# Altium schematic sheet NPN_CONNECTOR.SchDoc: BMS - AFE
size A4; DrawnBy: Jarod Krane; SheetNumber: 7; SheetTotal: 8
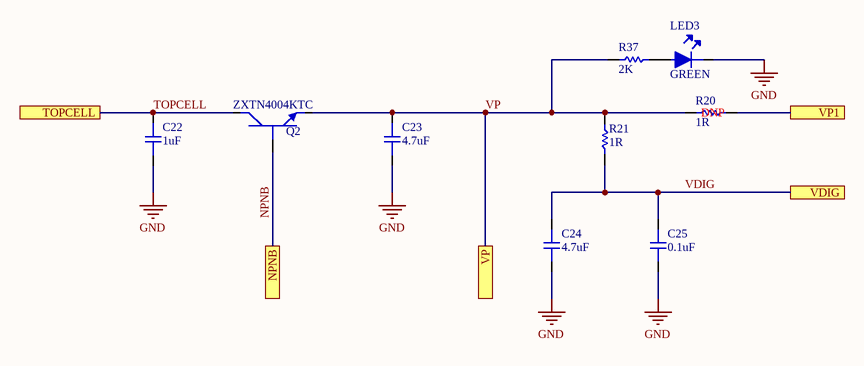
[diagram p0: NPN_CONNECTOR.SchDoc]

## Parts
C22  1uF  [0805 CAP]
C23  4.7uF  [1206 CAP]
C24  4.7uF  [0805 CAP]
C25  0.1uF  [0603 CAP - duplicate]
LED3  GREEN  [LED2]
Q2  ZXTN4004KTC  [NPN TRANSISTOR]
R20  1R  [0603 RES]
R21  1R  [0603 RES]
R37  2K  [0603 RES]

## Ports
NPNB, TOPCELL, VDIG, VP, VP1

## Nets
GND: C22.1 C23.1 C24.1 C25.1 LED3.2
NPNB: Q2.1 ; port NPNB
TOPCELL: C22.2 Q2.2 ; port TOPCELL
VDIG: C24.2 C25.2 R21.1 ; port VDIG
VP: C23.2 Q2.3 R20.1 R21.2 R37.1 ; port VP
VP1: R20.2 ; port VP1
NetLED3_1: LED3.1 R37.2

## Notes on the sheet
- (near R20) DNP

## Library data of the parts
C22 = C2012X7S2A105K125AE: CAP CER 1UF 100V X7S 0805; Manufacturer: TDK; Tolerance: 10%; Supplier 1: Digi-Key; Manufacturer Part Number: C2012X7S2A105K125AE; Stock 1: 20000; Pricing 1: 1=0.5, 10=0.356, 100=0.2347, 500=0.1739, 1000=0.1478 (USD); Mount: Surface Mount; Case/Package: 0805; Case Code (Metric): 2012; Case Code (Imperial): 0805; Min Operating Temperature: -55°C; Max Operating Temperature: 125°C; Capacitance: 1uF; Voltage Rating: 100V; Packaging: Tape and Reel; Termination: SMD/SMT; Package Quantity: 1; Voltage Rating (DC): 100V; Dielectric: X7S; Composition: Ceramic; Features: Soft Termination; Length: 2mm; Height: 1.25mm; Width: 0.05inch; Thickness: 0.049inch; Depth: 1.25mm; Lead Free: Lead Free; ComponentLink1URL: https://product.tdk.com/info/en/catalog/spec/mlccspec_commercial_soft_en.pdf; ComponentLink1Description: https://product.tdk.com/info/en/catalog/spec/mlccspec_commercial_soft_en.pdf; ComponentLink2URL: http://www.mouser.com/ds/2/400/lcc_commercial_soft_en-520032.pdf; ComponentLink2Description: http://www.mouser.com/ds/2/400/lcc_commercial_soft_en-520032.pdf; Supplier Part Number 1: 445-8887-1-ND
C23 = GRM31CR71H475KA12L: CAP CER 4.7UF 50V X7R 1206; Manufacturer: Murata; Material: Ceramic; Tolerance: 10%; Supplier 1: Digi-Key; Manufacturer Part Number: GRM31CR71H475KA12L; Stock 1: 0; Pricing 1: 1=0.98, 10=0.723, 100=0.4961, 500=0.3928, 1000=0.3307 (USD); Mount: Surface Mount; Case/Package: 1206; Case Code (Metric): 3216; Case Code (Imperial): 1206; Min Operating Temperature: -55°C; Max Operating Temperature: 125°C; Capacitance: 4.7uF; Voltage Rating: 50V; Packaging: Tape and Reel; Voltage Rating (DC): 50V; Package Quantity: 2000; Dielectric: X7R; Termination: SMD/SMT; Voltage: 50V; Length: 3.2mm; Height: 1.6mm; Width: 0.063inch; Thickness: 0.071inch; Depth: 1.6mm; Radiation Hardening: No; REACH SVHC: No SVHC; Lead Free: Lead Free; Supplier Part Number 1: 490-6521-1-ND
C24 = CL21B475KOFNFNE: CAP CER 4.7UF 16V X7R 0805; Manufacturer: Samsung; Tolerance: 10%; Supplier 1: Digi-Key; Manufacturer Part Number: CL21B475KOFNFNE; Stock 1: 20000; Pricing 1: 1=0.3, 10=0.208, 100=0.1181, 500=0.0833, 1000=0.0729 (USD); Mount: Surface Mount; Case/Package: 0805; Case Code (Metric): 2012; Case Code (Imperial): 0805; Min Operating Temperature: -55°C; Max Operating Temperature: 125°C; Package Quantity: 1; Packaging: Tape and Reel; Capacitance: 4.7uF; Voltage Rating: 16V; Dielectric: X7R; Length: 0.079inch; Height: 1.25mm; Width: 0.049inch; Thickness: 0.053inch; Depth: 1.25mm; Radiation Hardening: No; Supplier Part Number 1: 1276-2970-1-ND
C25 = 06035C104KAZ2A: CAP CER 0.1UF 50V X7R 0603; Manufacturer: Kyocera AVX; Capacitance: 100nF; Tolerance: 10%; Temperature Coefficient: 30ppm/°C; Supplier 1: Digi-Key; Manufacturer Part Number: 06035C104KAZ2A; Stock 1: 40000; Pricing 1: 1=0.23, 10=0.161, 100=0.0756, 500=0.053, 1000=0.0439 (USD); Mount: PCB,Surface Mount; Case/Package: 0603; Number of Pins: 2; Case Code (Metric): 1608; Case Code (Imperial): 0603; Contact Plating: Matte,Tin; Min Operating Temperature: -55°C; Max Operating Temperature: 125°C; Package Quantity: 1; Voltage Rating: 50V; Packaging: Tape and Reel; Voltage Rating (DC): 50V; Dielectric: X7R; Termination: SMD/SMT; Voltage: 50V; Features: Soft Termination; Length: 1.6mm; Height: 0.94mm; Width: 0.032inch; Thickness: 0.035inch; Depth: 0.81mm; Radiation Hardening: No; REACH SVHC: No SVHC; Lead Free: Lead Free; Supplier Part Number 1: 478-3540-1-ND
LED3 = 150060VS75000: LED GREEN CLEAR 0603 SMD; Manufacturer: Wurth Electronics; Luminous Intensity: 40mcd; Viewing Angle: 140°; Forward Voltage: 2V; Wavelength: 570nm; Lens Style: Clear,Rectangular; Forward Current: 30mA; Test Current: 20mA; Supplier 1: Digi-Key; Manufacturer Part Number: 150060VS75000; Stock 1: 219425; Pricing 1: 1=0.14, 50=0.129, 100=0.11, 500=0.095 (USD); Mount: Surface Mount; Case/Package: 0603; Number of Pins: 2; Colour: Green; Case Code (Metric): 1608; Case Code (Imperial): 0603; Min Operating Temperature: -40°C; Max Operating Temperature: 85°C; Package Quantity: 1; Packaging: Tape and Reel; Dominant Wavelength: 570nm; Length: 1.6mm; Height: 0.7mm; Width: 0.8mm; REACH SVHC: Unknown; ComponentLink1URL: http://www.farnell.com/datasheets/1911347.pdf; ComponentLink1Description: http://www.farnell.com/datasheets/1911347.pdf; ComponentLink2URL: https://katalog.we-online.de/led/datasheet/150060VS75000.pdf; ComponentLink2Description: https://katalog.we-online.de/led/datasheet/150060VS75000.pdf; ComponentLink3URL: https://www.distrelec.biz/Web/Downloads/_t/ds/150060VS75000_eng_tds.pdf?mime=application%2Fpdf; ComponentLink3Description: https://www.distrelec.biz/Web/Downloads/_t/ds/150060VS75000_eng_tds.pdf?mime=application%2Fpdf; ComponentLink4URL: http://www.produktinfo.conrad.com/datenblaetter/750000-774999/759431-da-01-en-CHIPLED_0603_W_KL_H_GRUEN_150060VS7500.pdf; ComponentLink4Description: http://www.produktinfo.conrad.com/datenblaetter/750000-774999/759431-da-01-en-CHIPLED_0603_W_KL_H_GRUEN_150060VS7500.pdf; Supplier Part Number 1: 732-4980-1-ND
Q2 = ZXTN4004KTC: TRANS NPN 150V 1A TO252; Manufacturer: Diodes; Max Power Dissipation: 3.8W; Number of Elements: 1; hFE Min: 100; Emitter Base Voltage (VEBO): 7V; Element Configuration: Single; Supplier 1: Digi-Key; Manufacturer Part Number: ZXTN4004KTC; Stock 1: 27399; Pricing 1: 1=0.49, 10=0.42, 100=0.3134, 500=0.2463, 1000=0.1903 (USD); Mount: Surface Mount; Case/Package: TO-252; Number of Pins: 3; Weight: 0.063493oz; Min Operating Temperature: -55°C; Max Operating Temperature: 150°C; Packaging: Tape and Reel; Package Quantity: 2500; Polarity: NPN; Collector Emitter Voltage (VCEO): 150V; Collector Base Voltage (VCBO): 150V; Continuous Collector Current: 1A; Max Collector Current: 1A; Collector Emitter Breakdown Voltage: 150V; Max Breakdown Voltage: 150V; Power Dissipation: 3.8W; Length: 6.7mm; Height: 6.2mm; Width: 2.39mm; Radiation Hardening: No; Lead Free: Lead Free; REACH SVHC: No SVHC; Supplier Part Number 1: ZXTN4004KTCDICT-ND
R20 R21 = CRL0603-FW-1R00ELF: RES SMD 1 OHM 1% 1/10W 0603; Manufacturer: Bourns; Power Rating: 100mW; Temperature Coefficient: 200ppm/°C; Supplier 1: Digi-Key; Manufacturer Part Number: CRL0603-FW-1R00ELF; Stock 1: 1350; Pricing 1: 1=0.13, 10=0.116, 100=0.0448, 1000=0.0197, 2500=0.017 (USD); Mount: Surface Mount; Case/Package: 0603; Case Code (Metric): 1608; Case Code (Imperial): 0603; Contact Plating: Tin; Min Operating Temperature: -55°C; Max Operating Temperature: 125°C; Resistance: 1R; Packaging: Tape and Reel; Tolerance: 1%; Package Quantity: 5000; Composition: Thick Film; Number of Terminations: 2; Termination: SMD/SMT; Military Standard: Not; Max Power Dissipation: 100mW; Length: 1.6mm; Height: 0.45mm; Width: 0.8mm; Depth: 0.8mm; Radiation Hardening: No; REACH SVHC: No SVHC; Supplier Part Number 1: CRL0603-FW-1R00ELFCT-ND
R37 = CRCW06032K00FKEA: RES SMD 2K OHM 1% 1/10W 0603; Manufacturer: Vishay; Power Rating: 100mW; Resistance: 2kR; Voltage Rating: 75V; Temperature Coefficient: 100ppm/°C; Supplier 1: Digi-Key; Manufacturer Part Number: CRCW06032K00FKEA; Stock 1: 388348; Pricing 1: 1=0.1, 10=0.042, 100=0.017, 1000=0.0076, 2500=0.0066 (USD); Mount: Surface Mount; Case/Package: 0603; Number of Pins: 2; Weight: 7.1E-05oz; Case Code (Imperial): 0603; Case Code (Metric): 1608; Contact Plating: Lead,Tin; Min Operating Temperature: -55°C; Max Operating Temperature: 155°C; Tolerance: 1%; Packaging: Tape and Reel; Composition: Thick Film; Package Quantity: 10; Military Standard: Not; Termination: Solder; Voltage Rating (DC): 75V; Number of Terminations: 2; Max Power Dissipation: 100mW; Features: Automotive AEC-Q200; Length: 1.55mm; Height: 0.45mm; Width: 0.85mm; Depth: 0.85mm; Radiation Hardening: No; REACH SVHC: Unknown; Lead Free: Lead Free; Supplier Part Number 1: 541-2.00KHCT-ND